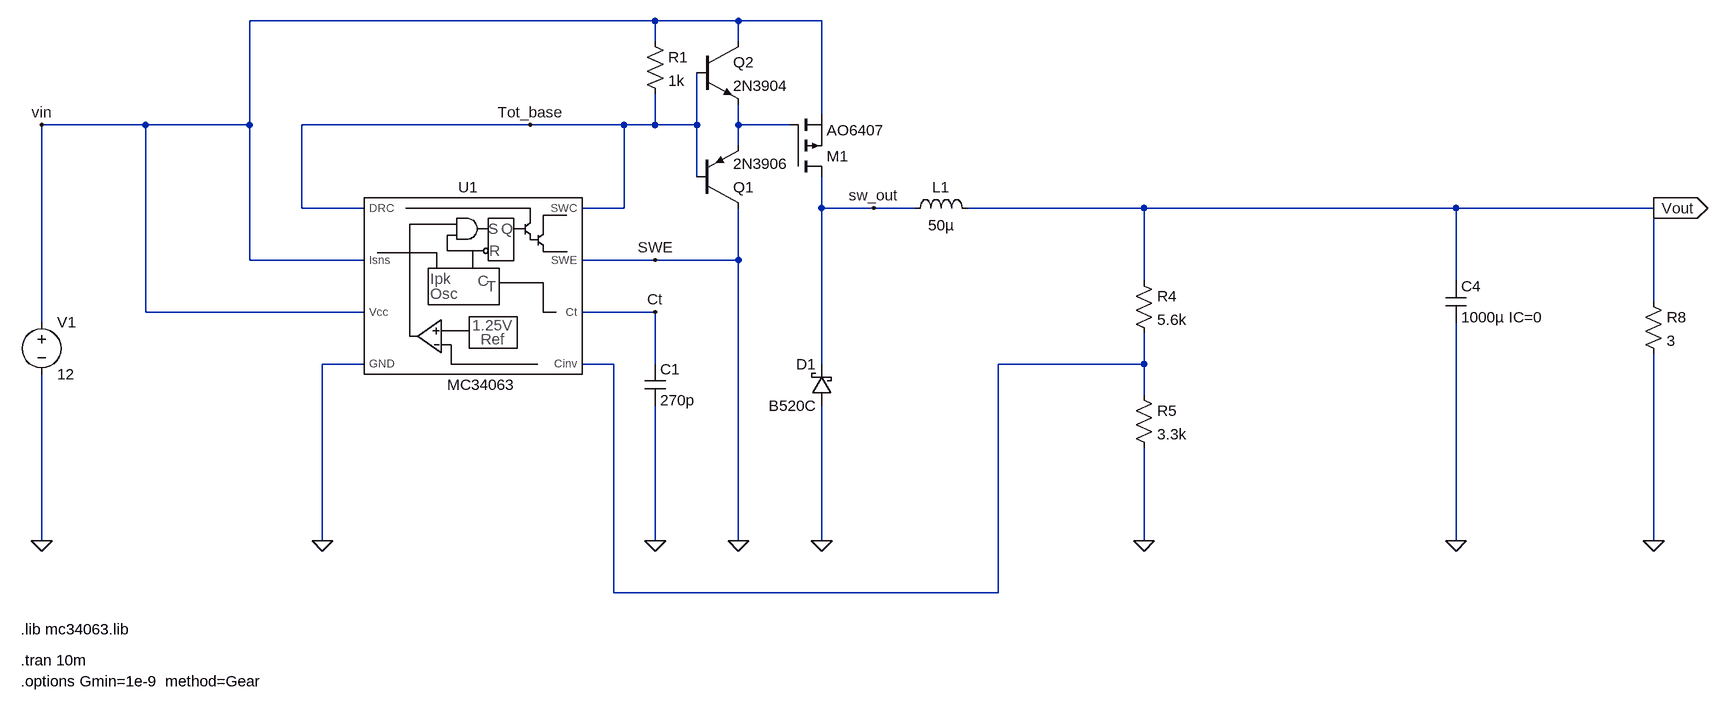
[diagram p0: schematic LV_PSU.asc]
LV_PSU.asc, the LTspice schematic file:
Version 4
SHEET 1 1968 696
WIRE 320 -336 -304 -336
WIRE 448 -336 320 -336
WIRE 576 -336 448 -336
WIRE 320 -304 320 -336
WIRE 448 -304 448 -336
WIRE 576 -192 576 -336
WIRE -464 -176 -624 -176
WIRE -304 -176 -304 -336
WIRE -304 -176 -464 -176
WIRE 128 -176 -224 -176
WIRE 272 -176 128 -176
WIRE 320 -176 320 -224
WIRE 320 -176 272 -176
WIRE 384 -176 384 -256
WIRE 384 -176 320 -176
WIRE 448 -176 448 -208
WIRE 528 -176 448 -176
WIRE 448 -144 448 -176
WIRE 384 -96 384 -176
WIRE -224 -48 -224 -176
WIRE -128 -48 -224 -48
WIRE 272 -48 272 -176
WIRE 272 -48 208 -48
WIRE 576 -48 576 -96
WIRE 656 -48 576 -48
WIRE 720 -48 656 -48
WIRE 1072 -48 800 -48
WIRE 1552 -48 1072 -48
WIRE 1856 -48 1552 -48
WIRE -304 32 -304 -176
WIRE -128 32 -304 32
WIRE 320 32 208 32
WIRE 448 32 448 -48
WIRE 448 32 320 32
WIRE 1072 64 1072 -48
WIRE 1552 64 1552 -48
WIRE 1856 96 1856 -48
WIRE -464 112 -464 -176
WIRE -128 112 -464 112
WIRE 320 112 208 112
WIRE -624 128 -624 -176
WIRE -128 192 -192 192
WIRE 256 192 208 192
WIRE 320 192 320 112
WIRE 576 192 576 -48
WIRE 1072 192 1072 144
WIRE 1072 192 848 192
WIRE 1072 240 1072 192
WIRE -624 464 -624 208
WIRE -192 464 -192 192
WIRE 320 464 320 256
WIRE 448 464 448 32
WIRE 576 464 576 256
WIRE 1072 464 1072 320
WIRE 1552 464 1552 128
WIRE 1856 464 1856 176
WIRE 256 544 256 192
WIRE 848 544 848 192
WIRE 848 544 256 544
FLAG -192 464 0
FLAG 320 464 0
FLAG 1072 464 0
FLAG 1552 464 0
FLAG -624 464 0
FLAG 1856 -48 Vout
IOPIN 1856 -48 Out
FLAG 320 112 Ct
FLAG -624 -176 vin
FLAG 1856 464 0
FLAG 576 464 0
FLAG 448 464 0
FLAG 128 -176 Tot_base
FLAG 320 32 SWE
FLAG 656 -48 sw_out
SYMBOL cap 304 192 R0
SYMATTR InstName C1
SYMATTR Value 270p
SYMBOL res 1056 48 R0
SYMATTR InstName R4
SYMATTR Value 5.6k
SYMBOL res 1056 224 R0
SYMATTR InstName R5
SYMATTR Value 3.3k
SYMBOL cap 1536 64 R0
SYMATTR InstName C4
SYMATTR Value 1000µ IC=0
SYMBOL voltage -624 112 R0
SYMATTR InstName V1
SYMATTR Value 12
SYMBOL res 1840 80 R0
SYMATTR InstName R8
SYMATTR Value 3
SYMBOL mc34063 112 48 R0
SYMATTR InstName U1
SYMBOL ind 704 -32 R270
WINDOW 0 32 56 VTop 2
WINDOW 3 5 56 VBottom 2
SYMATTR InstName L1
SYMATTR Value 50µ
SYMATTR SpiceLine Rser=0.2
SYMBOL schottky 592 256 R180
WINDOW 0 24 64 Left 2
WINDOW 3 24 0 Left 2
SYMATTR InstName D1
SYMATTR Value B520C
SYMATTR Description Diode
SYMATTR Type diode
SYMBOL pnp 384 -48 M180
SYMATTR InstName Q1
SYMATTR Value 2N3906
SYMBOL npn 384 -304 R0
SYMATTR InstName Q2
SYMATTR Value 2N3904
SYMBOL pmos 528 -96 M180
SYMATTR InstName M1
SYMATTR Value AO6407
SYMBOL res 304 -320 R0
SYMATTR InstName R1
SYMATTR Value 1k
TEXT -656 648 Left 2 !.tran 10m
TEXT -656 680 Left 2 !.options Gmin=1e-9  method=Gear
TEXT -656 600 Left 2 !.lib mc34063.lib

The netlist it stands for:
* LV_PSU.asc
C1 Ct 0 270p
R4 Vout N002 5.6k
R5 N002 0 3.3k
C4 Vout 0 1000µ IC=0
V1 vin 0 12
R8 Vout 0 3
XU1 Tot_base 0 Ct 0 N002 vin vin Tot_base MC34063  ; pins SWC SWE Ct GND Cinv Vcc Isns DRC
L1 sw_out Vout 50µ Rser=0.2
D1 0 sw_out B520C
Q1 0 Tot_base N001 0 2N3906
Q2 vin Tot_base N001 0 2N3904
M1 sw_out N001 vin vin AO6407
R1 vin Tot_base 1k
.model D D
.lib standard.dio
.model NPN NPN
.model PNP PNP
.lib standard.bjt
.model NMOS NMOS
.model PMOS PMOS
.lib standard.mos
.tran 10m
.options Gmin=1e-9  method=Gear
.lib mc34063.lib
.lib MC34063.sub
.backanno
.end